# Altium schematic sheet MOTOR.SchDoc
size 203 x 203 mm; SheetNumber: 4; SheetTotal: 5
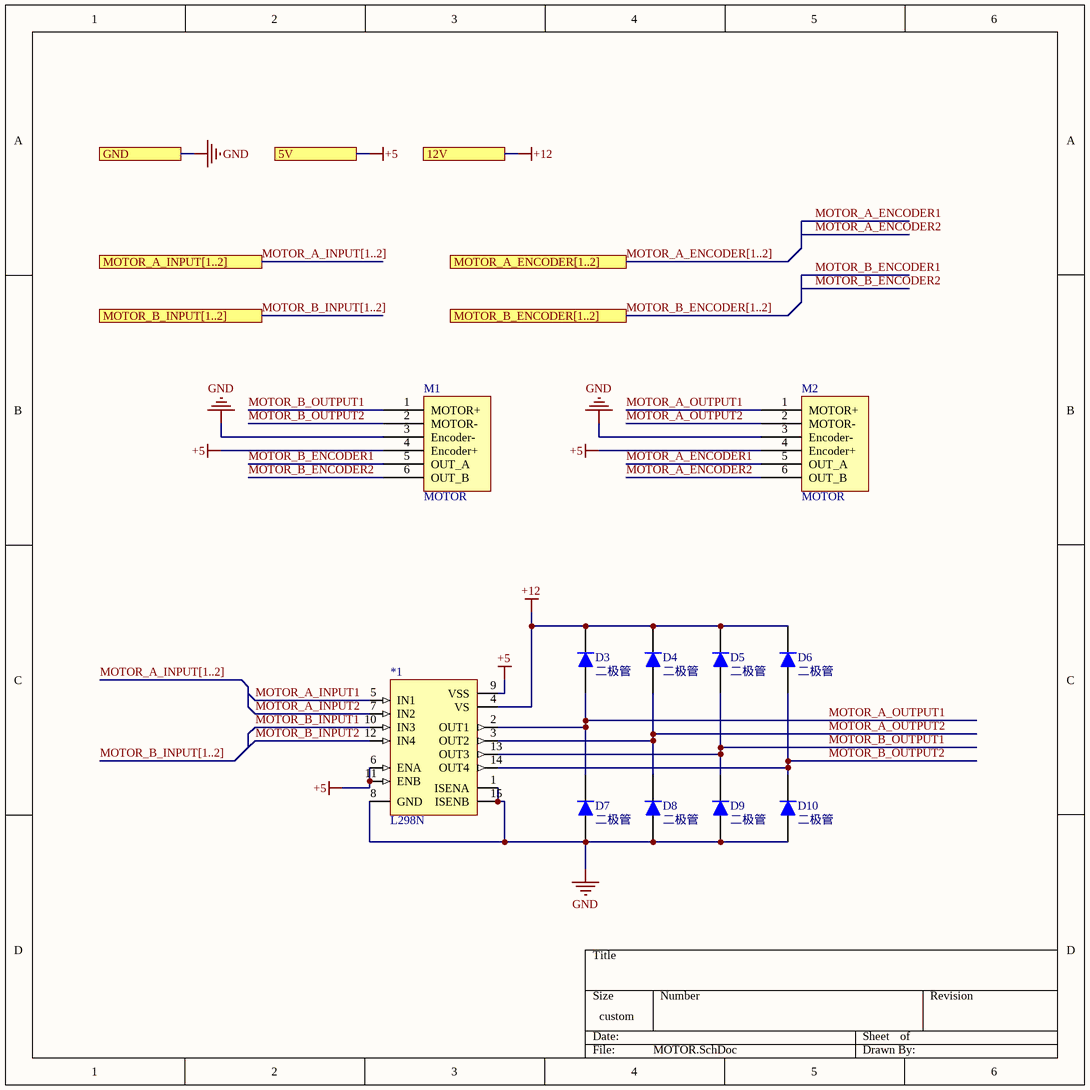
[diagram p0: MOTOR.SchDoc]

## Parts
*1  L298N  [L298N-DIP]
D3  二极管  [SOD-323]
D4  二极管  [SOD-323]
D5  二极管  [SOD-323]
D6  二极管  [SOD-323]
D7  二极管  [SOD-323]
D8  二极管  [SOD-323]
D9  二极管  [SOD-323]
D10  二极管  [SOD-323]
M1  MOTOR  [MOTOR_PORT ClearVer]
M2  MOTOR  [MOTOR_PORT ClearVer]

## Ports
5V, 12V, GND, MOTOR_A_ENCODER[1..2], MOTOR_A_INPUT[1..2], MOTOR_B_ENCODER[1..2], MOTOR_B_INPUT[1..2]

## Nets
+5: *1.6(ENA) *1.9(VSS) *1.11(ENB) M1.4(Encoder+) M2.4(Encoder+) ; port 5V
+12: *1.4(VS) D3.1 D4.1 D5.1 D6.1 ; port 12V
GND: *1.1(ISENA) *1.8(GND) *1.15(ISENB) D7.2 D8.2 D9.2 D10.2 M1.3(Encoder-) M2.3(Encoder-) ; port GND
MOTOR_A_ENCODER1: M2.5(OUT_A)
MOTOR_A_ENCODER2: M2.6(OUT_B)
MOTOR_A_INPUT1: *1.5(IN1)
MOTOR_A_INPUT2: *1.7(IN2)
MOTOR_A_OUTPUT1: *1.2(OUT1) D3.2 D7.1 M2.1(MOTOR+)
MOTOR_A_OUTPUT2: *1.3(OUT2) D4.2 D8.1 M2.2(MOTOR-)
MOTOR_B_ENCODER1: M1.5(OUT_A)
MOTOR_B_ENCODER2: M1.6(OUT_B)
MOTOR_B_INPUT1: *1.10(IN3)
MOTOR_B_INPUT2: *1.12(IN4)
MOTOR_B_OUTPUT1: *1.13(OUT3) D5.2 D9.1 M1.1(MOTOR+)
MOTOR_B_OUTPUT2: *1.14(OUT4) D6.2 D10.1 M1.2(MOTOR-)

## Buses and harness runs
bus MOTOR_A_ENCODER[1..2] = port MOTOR_A_ENCODER[1..2]
bus MOTOR_A_INPUT[1..2]
bus MOTOR_A_INPUT[1..2] = port MOTOR_A_INPUT[1..2]
bus MOTOR_B_ENCODER[1..2] = port MOTOR_B_ENCODER[1..2]
bus MOTOR_B_INPUT[1..2]
bus MOTOR_B_INPUT[1..2] = port MOTOR_B_INPUT[1..2]

## Library data of the parts
D3-D10 = 二极管 SOD323
M1 M2 = MOTOR_Port